# EAGLE board bms1818 (EAGLE 4.13), part 1 of 2
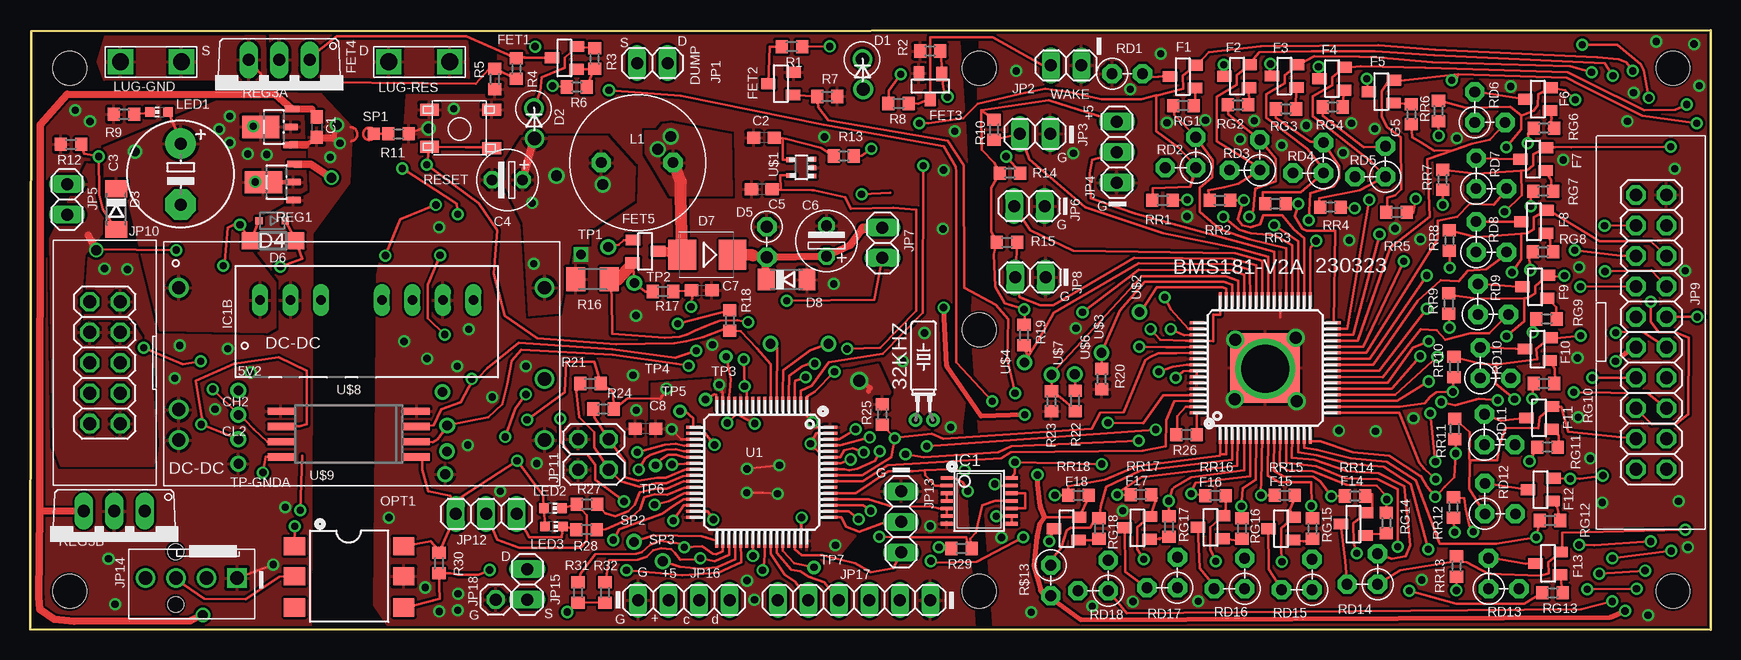
[diagram p2: board, top side]
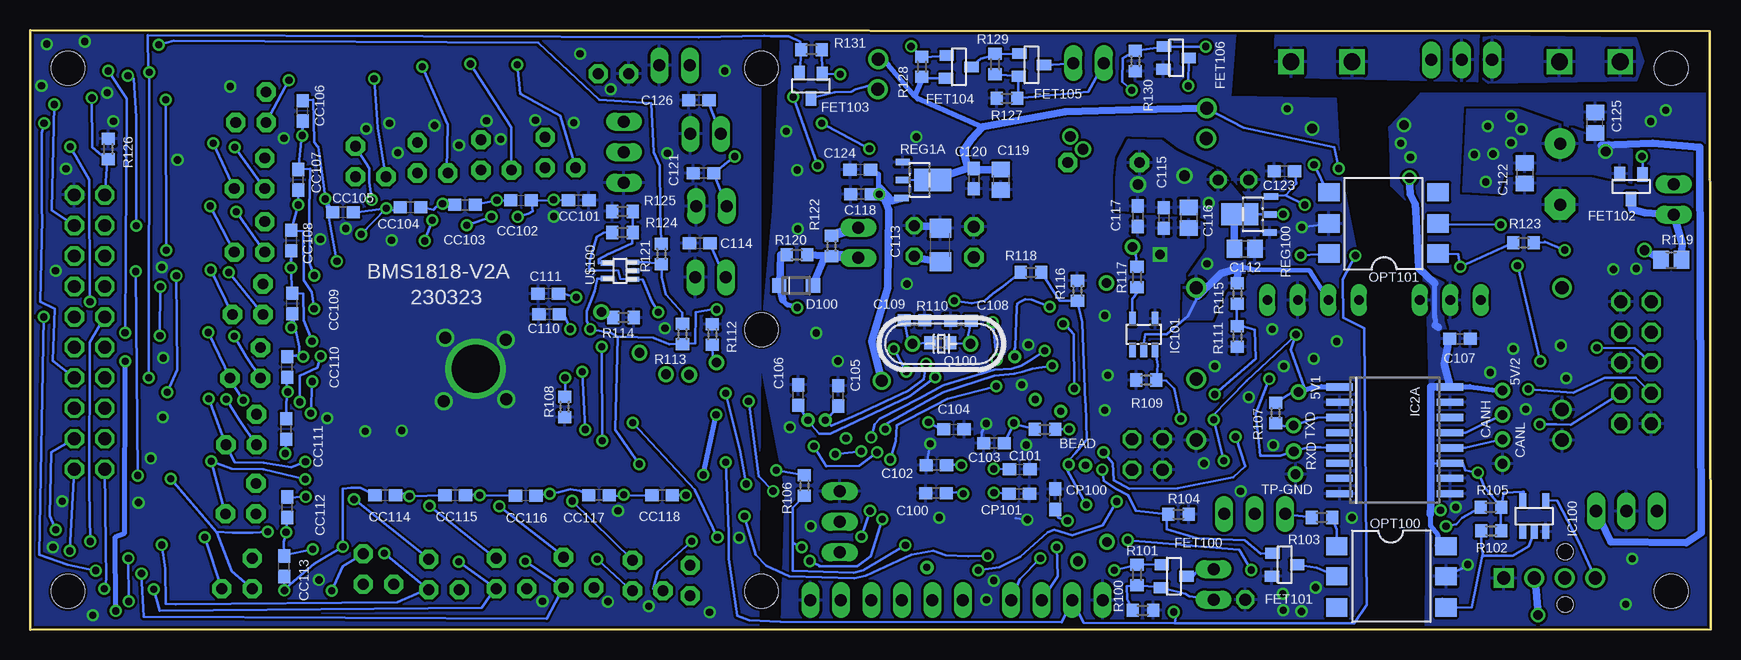
[diagram p3: board, bottom side, seen from below]

Size 140.07 x 49.98 mm. Coordinates in mm from the lower left corner, seen from the top.
Outline: 0,0.03 0.11,49.88 140.07,49.98 140.05,0 0,0.03
Copper layers (1*16): Top 0.035mm / dielectric 1.5mm / Bottom 0.035mm
Design rules "default": minimum track width 8mil, minimum drill 0.6mm, track to track 8mil, track to pad 8mil, pad to pad 8mil, via to via 8mil, smd to smd 0mil, copper to edge 8mil, drill to drill 8mil, minimum pad ring 10mil, minimum via ring 8mil, stop-mask expansion 4mil, vias tented up to drill 0mil, thermal gap 10mil
Holes 2.8 mm at 3.31,46.8 3.31,3.2 136.91,3.2 136.91,46.8 79.11,3.2 79.11,46.8 79.11,25

## Footprints (pad centres in the part's own frame; a part is rotated, then mirrored left to right if it is on the bottom)
SOLPAD028 = drill 0.8 pad 1.1 round: MP 0,0
32KHZ = drill 0.6 round: 1 -0.67,-3.1; 2 0.77,-3.1
R0603 = smd 1 x 1.1: 1 -0.85,0; 2 0.85,0
C0603 = smd 1.1 x 1: 1 -0.85,0; 2 0.85,0
E5-8,5 = drill 1.016 pad 2.54 round: + -2.54,0 | drill 1.016 pad 2.54 octagon: - 2.54,0
ES-2,5L = drill 0.889 pad 1.27 octagon: 1 0,0; 2 2.54,0
C0805 = smd 1.3 x 1.5: 1 -0.85,0; 2 0.85,0
C1206 = smd 1.6 x 1.8: 1 -1.4,0; 2 1.4,0
DO41-10_VERT = drill 1.1 round: A 2.58,0.05; C 0.07,0
SOD80C = smd 1.4 x 1.8: A 1.7,0; C -1.7,0
SOD323-R = smd 0.6 x 0.6: A 1.1,0; C -1.1,0
ZENER-VERT = drill 1 pad 1.6 octagon: 1 0,0; 2 2.54,0
SOD123 = smd 1.4 x 1.4: A 1.9,0; C -1.9,0
SMB_1 = smd 2.3 x 2.5: A 1.9,0; C -2.3,0
SOD123W = smd 1.2 x 1.2: A 1.4,0; C -1.4,0
SOT-23 = smd 0.9 x 1.2: 1 -1,-1.006; 2 0.9,-1.056; 3 -0.05,1.056
TO220V = drill 1.016 long: 1 -2.54,-2.54; 2 0,-2.54; 3 2.54,-2.54
TSSOP14 = smd 0.305 x 0.991: 1 -1.905,-2.718; 2 -1.27,-2.718; 3 -0.635,-2.718; 4 0,-2.718; 5 0.635,-2.718; 6 1.27,-2.718; 7 1.905,-2.718; 8 1.905,2.718; 9 1.27,2.718; 10 0.635,2.718; 11 0,2.718; 12 -0.635,2.718; 13 -1.27,2.718; 14 -1.905,2.718
DCDC7PINB = drill 0.813 long: 1 -7.62,2.51; 2 -5.08,2.51; 3 -2.54,2.51; 5 2.54,2.51; 6 5.08,2.51; 7 7.62,2.51; 8 10.16,2.51
SO-16DW = smd 0.6 x 2.2: 1 -4.445,-4.6; 2 -3.175,-4.6; 3 -1.905,-4.6; 4 -0.635,-4.6; 5 0.635,-4.6; 6 1.905,-4.6; 7 3.175,-4.6; 8 4.445,-4.6; 9 4.445,4.6; 10 3.175,4.6; 11 1.905,4.6; 12 0.635,4.6; 13 -0.635,4.6; 14 -1.905,4.6; 15 -3.175,4.6; 16 -4.445,4.6
SOT-23' = smd 0.6 x 1.2: 1 -0.95,-1.306; 2 0,-1.306; 3 0.95,-1.306; 4 0.95,1.306; 5 -0.95,1.306
SOT23-5 = smd 0.55 x 1.2: 1 -0.95,-1.3; 2 0,-1.3; 3 0.95,-1.3; 4 0.95,1.3; 5 -0.95,1.3
1X02 = drill 1 long: 1 -1.27,0; 2 1.27,0
1X03 = drill 1 long: 1 -2.54,0; 2 0,0; 3 2.54,0
2X10_KEYED = drill 1.067 octagon: 1 -11.46,-1.27; 2 -11.46,1.27; 3 -8.92,-1.27; 4 -8.92,1.27; 5 -6.38,-1.27; 6 -6.38,1.27; 7 -3.84,-1.27; 8 -3.84,1.27; 9 -1.3,-1.27; 10 -1.3,1.27; 11 1.24,-1.27; 12 1.24,1.27; 13 3.78,-1.27; 14 3.78,1.27; 15 6.32,-1.27; 16 6.32,1.27; 17 8.86,-1.27; 18 8.86,1.27; 19 11.4,-1.27; 20 11.4,1.27
2X05_KEYED = drill 1.067 octagon: 1 -5.08,-1.27; 2 -5.08,1.27; 3 -2.54,-1.27; 4 -2.54,1.27; 5 0,-1.27; 6 0,1.27; 7 2.54,-1.27; 8 2.54,1.27; 9 5.08,-1.27; 10 5.08,1.27
2X02 = drill 1.016 octagon: 1 -1.27,-1.27; 2 -1.27,1.27; 3 1.27,-1.27; 4 1.27,1.27
1X4-MOLEXKK = drill 1.1 square: 1 3.81,0 | drill 1.1 round: 2 1.27,0; 3 -1.27,0; 4 -3.81,0 | hole 1.3: -1.3,2.2; -1.3,-2.2
1X04 = drill 1 long: 1 -3.81,0; 2 -1.27,0; 3 1.27,0; 4 3.81,0
1X06 = drill 1 long: 1 -6.35,0; 2 -3.81,0; 3 -1.27,0; 4 1.27,0; 5 3.81,0; 6 6.35,0
1X01 = drill 1 octagon: 1 0,0
INDUCTOR6.0 = drill 0.9 pad 1.6 octagon: 1 -3.04,0; 2 2.94,0
CHIP-LED0603 = smd 0.8 x 0.8: A 0,-0.75; C 0,0.75
SPADE_TAB = drill 1.4 square: G1 -2.54,0; G2 2.54,0
SMD-6 = smd 1.52 x 1.78: P$1 -2.5,-4.5; P$2 0,-4.5; P$3 2.6,-4.5; P$4 2.6,4.6; P$5 0,4.6; P$6 -2.5,4.6
HC49/S = drill 0.8 round: 1 -2.413,0; 2 2.413,0
M1206 = smd 1.6 x 2: 1 -1.4,0; 2 1.4,0
R0805 = smd 1.3 x 1.5: 1 -0.85,0; 2 0.85,0
RS-2,5 = drill 0.889 pad 1.6 octagon: 1 0,0; 2 2.54,0
RS-2,5-2 = drill 0.889 pad 1.6 octagon: 1 0,0; 2 2.54,0; 3 0,2.54
SOT89 = smd 0.55 x 1.2: 1 -1.5,-1.4; 2 0,-1.4; 3 1.5,-1.5 | smd 1.85 x 3.1: 4 0,1.1
TO220V' = drill 1.016 long: 1 -3.81,-1.27; 2 -1.27,-1.27; 3 1.27,-1.27
E-SWITCH2 = smd 1.55 x 1: 1 -2.7,1.6; 2 2.5,1.5; 3 2.5,-1.6; 4 -2.7,-1.6
SMD03 = smd 1 x 1: 1 0,0
SOLPAD.6MM = drill 0.6 pad 1.1 round: MP 0,0
TQFP64 = smd 1.2 x 0.26: 1 -5.7,3.75; 2 -5.7,3.25; 3 -5.7,2.75; 4 -5.7,2.25; 5 -5.7,1.75; 6 -5.7,1.25; 7 -5.7,0.75; 8 -5.7,0.25; 9 -5.7,-0.25; 10 -5.7,-0.75; 11 -5.7,-1.25; 12 -5.7,-1.75; 13 -5.7,-2.25; 14 -5.7,-2.75; 15 -5.7,-3.25; 16 -5.7,-3.75; 33 5.7,-3.75; 34 5.7,-3.25; 35 5.7,-2.75; 36 5.7,-2.25; 37 5.7,-1.75; 38 5.7,-1.25; 39 5.7,-0.75; 40 5.7,-0.25; 41 5.7,0.25; 42 5.7,0.75; 43 5.7,1.25; 44 5.7,1.75; 45 5.7,2.25; 46 5.7,2.75; 47 5.7,3.25; 48 5.7,3.75 | smd 0.26 x 1.2: 17 -3.75,-5.7; 18 -3.25,-5.7; 19 -2.75,-5.7; 20 -2.25,-5.7; 21 -1.75,-5.7; 22 -1.25,-5.7; 23 -0.75,-5.7; 24 -0.25,-5.7; 25 0.25,-5.7; 26 0.75,-5.7; 27 1.25,-5.7; 28 1.75,-5.7; 29 2.25,-5.7; 30 2.75,-5.7; 31 3.25,-5.7; 32 3.75,-5.7; 49 3.75,5.7; 50 3.25,5.7; 51 2.75,5.7; 52 2.25,5.7; 53 1.75,5.7; 54 1.25,5.7; 55 0.75,5.7; 56 0.25,5.7; 57 -0.25,5.7; 58 -0.75,5.7; 59 -1.25,5.7; 60 -1.75,5.7; 61 -2.25,5.7; 62 -2.75,5.7; 63 -3.25,5.7; 64 -3.75,5.7
SOT-323-5 = smd 0.4 x 0.6: 1 -0.7,-0.95; 2 0,-0.95; 3 0.7,-0.95; 4 0.65,0.95; 5 -0.65,0.95
TQFP64_PAD = smd 1.2 x 0.26: 1 -5.7,3.75; 2 -5.7,3.25; 3 -5.7,2.75; 4 -5.7,2.25; 5 -5.7,1.75; 6 -5.7,1.25; 7 -5.7,0.75; 8 -5.7,0.25; 9 -5.7,-0.25; 10 -5.7,-0.75; 11 -5.7,-1.25; 12 -5.7,-1.75; 13 -5.7,-2.25; 14 -5.7,-2.75; 15 -5.7,-3.25; 16 -5.7,-3.75; 33 5.7,-3.75; 34 5.7,-3.25; 35 5.7,-2.75; 36 5.7,-2.25; 37 5.7,-1.75; 38 5.7,-1.25; 39 5.7,-0.75; 40 5.7,-0.25; 41 5.7,0.25; 42 5.7,0.75; 43 5.7,1.25; 44 5.7,1.75; 45 5.7,2.25; 46 5.7,2.75; 47 5.7,3.25; 48 5.7,3.75 | smd 0.26 x 1.2: 17 -3.75,-5.7; 18 -3.25,-5.7; 19 -2.75,-5.7; 20 -2.25,-5.7; 21 -1.75,-5.7; 22 -1.25,-5.7; 23 -0.75,-5.7; 24 -0.25,-5.7; 25 0.25,-5.7; 26 0.75,-5.7; 27 1.25,-5.7; 28 1.75,-5.7; 29 2.25,-5.7; 30 2.75,-5.7; 31 3.25,-5.7; 32 3.75,-5.7; 49 3.75,5.7; 50 3.25,5.7; 51 2.75,5.7; 52 2.25,5.7; 53 1.75,5.7; 54 1.25,5.7; 55 0.75,5.7; 56 0.25,5.7; 57 -0.25,5.7; 58 -0.75,5.7; 59 -1.25,5.7; 60 -1.75,5.7; 61 -2.25,5.7; 62 -2.75,5.7; 63 -3.25,5.7; 64 -3.75,5.7 | smd 5.8 x 5.8: V- 0,0
SOIC-8 = smd 0.6 x 2.2: 1 -1.905,-5.6; 2 -0.635,-5.6; 3 0.635,-5.6; 4 1.905,-5.6; 5 1.905,5.7; 6 0.635,5.7; 7 -0.635,5.7; 8 -1.905,5.7
PYJ6-OD = drill 1.1 round: P$1 -7.62,12.7; P$2 -7.62,2.54; P$3 -7.62,0; P$4 22.86,0; P$5 22.86,5.08; P$6 22.86,12.7
SC-70-5 = smd 0.4 x 0.95: 1 -0.705,-1.126; 2 -0.005,-1.126; 3 0.695,-1.126 | smd 0.45 x 0.95: 4 0.645,1.136; 5 -0.655,1.136

## Placement (x,y rotation side)
5V1  SOLDPAD028  [SOLPAD028]  34.37,19.81 0 top
5V2  SOLDPAD028  [SOLPAD028]  17.36,19.95 0 top
32KHZ  X100  [32KHZ]  74.47,20.57 0 top
BEAD  1  [R0603]  55.5,16.7 180 bottom
C1  1u 25v  [C0603]  23.9,41.88 270 top
C2  1u  [C0603]  61.17,41 180 top
C3  0.1u 25v  [E5-8,5]  12.56,37.97 270 top
C4  10@25V  [ES-2,5L]  41.05,37.49 180 top
C5  1u  [C0603]  60.98,36.69 180 top
C6  1u@100v  [ES-2,5L]  66.38,31.13 90 top
C7  0.1u  [C0603]  55.98,28.28 0 top
C8  0.1u  [C0603]  51.29,16.76 180 top
C100  0.1u  [C0603]  64.57,11.38 180 bottom
C101  0.1u  [C0603]  57.59,13.38 0 bottom
C102  1u  [C0603]  64.54,13.73 180 bottom
C103  100n  [C0603]  59.74,15.54 180 bottom
C104  0.1u  [C0603]  63.08,16.71 0 bottom
C105  22p  [C0603]  72.7,19.49 90 bottom
C106  22p  [C0603]  76.04,19.55 90 bottom
C107  4.7u 10v  [C0603]  20.91,24.25 0 bottom
C108  33p  [C0603]  62.49,25.76 180 bottom
C109  33p  [C0603]  66.37,25.78 0 bottom
C110  1u  [C0603]  96.81,26.28 180 bottom
C111  1u  [C0603]  96.88,28.01 180 bottom
C112  4.7u 25v  [C0805]  38.84,31.76 0 bottom
C113  1u@100v  [C1206]  64.2,32.06 90 bottom
C114  1u  [C0603]  84.26,32.2 180 bottom
C115  10n  [C0603]  45.59,34.32 270 bottom
C116  4.7u 25v  [C0805]  43.51,34.34 270 bottom
C117  0.1u 25v  [C0603]  47.76,34.46 270 bottom
C118  0.1u  [C0603]  70.82,36.31 180 bottom
C119  4.7u 25v  [C0805]  59.16,37.5 270 bottom
C120  0.1u 25v  [C0603]  61.42,37.59 270 bottom
C121  1u  [C0603]  83.95,38.04 180 bottom
C122  4.7u 25v  [C0805]  15.51,38.04 270 bottom
C123  4.7u 10v  [C0603]  35.54,38.2 180 bottom
C124  4.7u  [C0603]  70.88,38.33 180 bottom
C125  4.7u 25v  [C0805]  9.65,42.26 90 bottom
C126  1u  [C0603]  84.33,44.14 180 bottom
CANH  SOLDPAD028  [SOLPAD028]  17.36,17.91 0 top
CANL  SOLDPAD028  [SOLPAD028]  17.36,15.87 0 top
CC101  0.1u  [C0603]  94.34,35.8 0 bottom
CC102  0.1u  [C0603]  99.16,35.78 0 bottom
CC103  0.1u  [C0603]  103.82,35.42 0 bottom
CC104  0.1u  [C0603]  108.36,35.22 0 bottom
CC105  0.1u  [C0603]  113.99,34.81 0 bottom
CC106  0.1u  [C0603]  117.36,43.24 90 bottom
CC107  0.1u  [C0603]  117.71,37.5 90 bottom
CC108  0.1u  [C0603]  118.28,32.44 90 bottom
CC109  0.1u  [C0603]  118.23,27.18 90 bottom
CC110  0.1u  [C0603]  118.64,21.9 90 bottom
CC111  0.1u  [C0603]  118.72,16.73 90 bottom
CC112  0.1u  [C0603]  118.62,10.21 90 bottom
CC113  0.1u  [C0603]  118.89,5.29 90 bottom
CC114  0.1u  [C0603]  110.47,11.19 180 bottom
CC115  0.1u  [C0603]  104.63,11.2 180 bottom
CC116  0.1u  [C0603]  98.76,11.18 180 bottom
CC117  0.1u  [C0603]  92.66,11.23 180 bottom
CC118  0.1u  [C0603]  87.39,11.2 180 bottom
CP100  4.7u 6.3v  [C0603]  54.65,10.88 90 bottom
CP101  4.7u 6.3  [C0603]  57.63,11.33 0 bottom
D1  1N4148  [DO41-10_VERT]  69.38,47.62 270 top
D2  1N4148  [DO41-10_VERT]  42,43.52 270 top
D3  MMSZ52  [SOD80C]  7.19,35.05 270 top
D4  [SOD323-R]  20.18,34.09 180 top
D5  1N5357  [ZENER-VERT]  61.41,33.58 270 top
D6  1N4148  [SOD123]  20.26,32.41 180 top
D7  MBRS1100  [SMB_1]  56.25,31.23 180 top
D8  MMSZ52  [SOD80C]  63.05,29.18 0 top
D100  PMEG10020  [SOD123W]  76.23,28.68 180 bottom
F1  [SOT-23]  96.07,46.15 90 top
F2  [SOT-23]  100.59,46.18 90 top
F3  [SOT-23]  104.54,46.19 90 top
F4  [SOT-23]  108.5,45.97 90 top
F5  [SOT-23]  112.62,44.89 90 top
F6  [SOT-23]  125.66,44.27 90 top
F7  [SOT-23]  125.27,39.27 90 top
F8  [SOT-23]  125.33,34.05 90 top
F9  [SOT-23]  125.43,28.63 90 top
F10  [SOT-23]  125.64,23.44 90 top
F11  [SOT-23]  125.77,17.7 90 top
F12  [SOT-23]  125.89,11.73 90 top
F13  [SOT-23]  126.51,5.58 90 top
F14  [SOT-23]  110.29,8.86 90 top
F15  [SOT-23]  104.25,8.48 90 top
F16  [SOT-23]  98.38,8.59 90 top
F17  [SOT-23]  92.28,8.54 90 top
F18  [SOT-23]  86.38,8.48 90 top
FET1  PFET -20V  [SOT-23]  44.54,47.71 90 top
FET2  NFET 20V  [SOT-23]  62.58,45.56 90 top
FET3  NFET 20V  [SOT-23]  74.98,45.3 180 top
FET4  NFET 100V  [TO220V]  20.77,44.95 180 top
FET5  PMV280ENEA  [SOT-23]  51.27,31.48 270 top
FET100  NFET  [SOT-23]  44.75,4.41 270 bottom
FET101  NFET  [SOT-23]  35.52,5.37 270 bottom
FET102  PMV35EPE  [SOT-23]  6.7,36.94 180 bottom
FET103  PFET -20V  [SOT-23]  75.04,45.33 180 bottom
FET104  PFET -20V  [SOT-23]  62.67,46.85 270 bottom
FET105  NFET 100V si2324A  [SOT-23]  56.62,47.02 270 bottom
FET106  NFET 20V  [SOT-23]  44.56,47.6 270 bottom
G5  3.3K  [R0603]  115.11,42.96 90 top
IC1  7402  [TSSOP14]  79.1,10.74 270 top
IC1B  AM6G1215SNZ  [DCDC7PINB]  26.79,24.97 0 top
IC2A  ISO1042-16PIN  [SO-16DW]  26.33,15.79 270 bottom
IC100  74LVC1G14  [SOT-23']  14.72,9.47 0 bottom
IC101  MCP1401|1416  [SOT23-5]  47.26,24.62 0 bottom
JP1  DUMP  [1X02]  51.86,47.22 0 top
JP2  PB  [1X02]  86.35,47.03 180 top
JP3  THERM1  [1X02]  83.76,41.32 180 top
JP4  [1X03]  90.58,39.8 90 top
JP5  Dump2  [1X02]  3.09,35.86 90 top
JP6  THERM3  [1X02]  83.28,35.31 180 top
JP7  [1X02]  71.04,32.25 90 top
JP8  THERM2  [1X02]  83.36,29.37 180 top
JP9  PINHD-2X10_KEYED  [2X10_KEYED]  135.1,24.77 270 top
JP10  PINHD-2X5_KEYED  [2X05_KEYED]  6.24,22.26 90 top
JP11  [2X02]  46.96,14.61 270 top
JP12  [1X03]  38.02,9.65 0 top
JP13  SWD  [1X03]  72.59,8.99 270 top
JP14  PINHD-1X4-MOLEXKK  [1X4-MOLEXKK]  13.44,4.31 0 top
JP15  Dump2  [1X02]  41.44,3.79 90 top
JP16  [1X04]  54.49,2.48 0 top
JP17  FTDI  [1X06]  68.68,2.48 180 top
JP18  [1X01]  38.81,2.52 0 top
L1  RFB1010  [INDUCTOR6.0]  50.65,38.93 0 top
LED1  [CHIP-LED0603]  10.75,43.15 90 top
LED2  [CHIP-LED0603]  43.58,10.13 270 top
LED3  [CHIP-LED0603]  43.66,8.61 270 top
LUG-GND  MINUS  [SPADE_TAB]  10.08,47.33 0 top
LUG-RES  RESIS  [SPADE_TAB]  32.44,47.33 0 top
OPT1  H11L1S  [SMD-6]  26.55,4.46 270 top
OPT100  H11L1S  [SMD-6]  26.67,4.46 270 bottom
OPT101  H11L1S  [SMD-6]  27.23,33.85 90 bottom
Q100  8 MHz  [HC49/S]  64.12,23.83 180 bottom
R1  270K  [R0603]  63.49,48.59 180 top
R2  1M  [R0603]  75.02,48.23 0 top
R3  1M  [R0603]  47.05,47.59 90 top
R4  100K  [R0603]  40.53,46.76 90 top
R5  1K  [R0603]  38.73,45.89 270 top
R6  270K  [R0603]  45.56,45.23 180 top
R7  1M  [R0603]  66.44,44.44 0 top
R8  270K  [R0603]  72.39,43.86 0 top
R9  10K  [R0603]  7.83,42.96 0 top
R10  10K  [R0603]  80.34,41.67 270 top
R11  10M  [R0603]  30.71,41.33 0 top
R12  1M  [R0603]  3.42,40.45 180 top
R13  100K  [R0603]  67.81,39.48 0 top
R14  10K  [R0603]  81.65,38.05 0 top
R15  10K  [R0603]  81.42,32.28 0 top
R16  0.1  [M1206]  46.88,29.21 0 top
R17  1.2K  [R0603]  52.75,28.19 0 top
R18  10K  [R0603]  58.32,25.77 90 top
R19  10K  [R0603]  82.83,24.56 270 top
R20  TBD  [R0603]  89.31,20.89 90 top
R21  10K  [R0603]  46.7,20.52 0 top
R22  TBD  [R0603]  87.1,19.08 90 top
R23  TBD  [R0603]  85.12,19.04 90 top
R24  10K  [R0603]  47.78,18.39 0 top
R25  3.9K  [R0603]  71.02,17.95 90 top
R26  100  [R0603]  96.38,16.26 180 top
R27  6.8K  [R0603]  46.42,10.46 0 top
R28  3.3K  [R0603]  46.38,8.34 0 top
R29  470K  [R0603]  77.63,6.77 180 top
R30  10K  [R0603]  34.08,5.55 90 top
R31  3.3K  [R0603]  45.67,3.11 270 top
R32  3.3K  [R0603]  47.92,3.1 270 top
R100  10K  [R0603]  47.33,1.62 0 bottom
R101  1M  [R0603]  47.82,4.57 270 bottom
R102  10K  [R0603]  18.3,8.24 0 bottom
R103  1.8K  [R0603]  32.42,9.36 180 bottom
R104  1M  [R0603]  44.36,9.62 0 bottom
R105  1.8K  [R0603]  18.33,10.2 180 bottom
R106  470K  [R0603]  75.54,12.02 270 bottom
R107  100K  [R0603]  36.26,18.06 90 bottom
R108  18K  [R0603]  95.52,18.57 90 bottom
R109  100K  [R0603]  47.05,20.81 0 bottom
R110  1M  [R0603]  64.22,23.91 0 bottom
R111  6.8K  [R0603]  39.46,24.45 270 bottom
R112  OPEN?  [R0603]  83.21,24.62 90 bottom
R113  47k  [R0603]  85.7,24.63 90 bottom
R114  TBD  [R0603]  90.61,26.02 180 bottom
R115  33K  [R0603]  39.46,28.03 270 bottom
R116  3.3K  [R0603]  52.78,28.25 270 bottom
R117  6.8  [R0603]  47.82,29.38 270 bottom
R118  68K  [R0603]  56.65,29.78 180 bottom
R119  0.1  [R0805]  3.3,30.82 0 bottom
R120  open  [R0603]  76.16,31.25 0 bottom
R121  1.2K  [R0603]  87.46,31.33 270 bottom
R122  1  [R0603]  73.28,31.98 270 bottom
R123  3.3K  [R0603]  15.6,32.25 180 bottom
R124  10K  [R0603]  90.69,33.11 0 bottom
R125  1.2K  [R0603]  90.69,34.86 0 bottom
R126  open  [R0603]  133.55,40.06 270 bottom
R127  1  [R0603]  58.67,44.29 0 bottom
R128  1M  [R0603]  65.75,46.92 270 bottom
R129  100K  [R0603]  59.65,47.13 90 bottom
R130  1M  [R0603]  47.96,47.39 90 bottom
R131  1M  [R0603]  74.94,48.34 180 bottom
R$13  33  [RS-2,5]  85.06,5.38 270 top
RD1  33  [RS-2,5]  90.17,46.34 0 top
RD2  33  [RS-2,5-2]  97.14,38.5 90 top
RD3  33  [RS-2,5-2]  102.49,38.3 90 top
RD4  33  [RS-2,5-2]  107.79,38.06 90 top
RD5  33  [RS-2,5-2]  112.95,37.75 90 top
RD6  33  [RS-2,5-2]  120.39,42.28 0 top
RD7  33  [RS-2,5-2]  120.51,36.76 0 top
RD8  33  [RS-2,5-2]  120.51,31.47 0 top
RD9  33  [RS-2,5-2]  120.66,26.28 0 top
RD10  33  [RS-2,5-2]  120.86,20.97 0 top
RD11  33  [RS-2,5-2]  121.2,15.42 0 top
RD12  33  [RS-2,5-2]  121.24,9.66 0 top
RD13  33  [RS-2,5-2]  121.55,3.42 0 top
RD14  33  [RS-2,5-2]  112.3,3.79 90 top
RD15  33  [RS-2,5-2]  106.84,3.34 90 top
RD16  33  [RS-2,5-2]  101.22,3.42 90 top
RD17  33  [RS-2,5-2]  95.62,3.5 90 top
RD18  33  [RS-2,5-2]  89.86,3.25 90 top
REG1  AP7380Y  [SOT89]  20.55,37.3 90 top
REG1A  AP7380Y  [SOT89]  65.94,37.48 270 bottom
REG3A  LDK320ADU120R  [SOT89]  20.32,41.9 90 top
REG3B  LM7812T  [TO220V']  5.76,8.62 180 top
REG100  AP7380Y  [SOT89]  38.16,34.62 90 bottom
RESET  RESET  [E-SWITCH2]  35.78,41.74 180 top
RG1  3.3K  [R0603]  96.11,43.67 0 top
RG2  3.3K  [R0603]  100.65,43.74 0 top
RG3  3.3K  [R0603]  104.67,43.4 0 top
RG4  3.3K  [R0603]  108.56,43.57 0 top
RG6  3.3K  [R0603]  126.18,41.8 0 top
RG7  3.3K  [R0603]  126.1,36.55 0 top
RG8  3.3K  [R0603]  126.09,31.49 0 top
RG9  3.3K  [R0603]  126.39,25.9 0 top
RG10  3.3K  [R0603]  126.15,20.53 0 top
RG11  3.3K  [R0603]  126.46,15.22 0 top
RG12  3.3K  [R0603]  126.68,9.1 0 top
RG13  3.3K  [R0603]  126.89,3.08 0 top
RG14  3.3K  [R0603]  113.03,8.91 270 top
RG15  3.3K  [R0603]  106.87,8.43 270 top
RG16  3.3K  [R0603]  101,8.44 270 top
RG17  3.3K  [R0603]  94.92,8.59 270 top
RG18  3.3K  [R0603]  89.09,8.44 270 top
RR1  10  [R0603]  94.39,35.79 180 top
RR2  10  [R0603]  99.15,35.79 180 top
RR3  10  [R0603]  103.79,35.5 180 top
RR4  10  [R0603]  108.37,35.22 180 top
RR5  10  [R0603]  113.89,34.78 180 top
RR6  10  [R0603]  117.37,43.24 90 top
RR7  10  [R0603]  117.72,37.5 90 top
RR8  10  [R0603]  118.28,32.44 90 top
RR9  10  [R0603]  118.23,27.18 90 top
RR10  10  [R0603]  118.66,21.91 90 top
RR11  10  [R0603]  118.73,16.73 90 top
RR12  10  [R0603]  118.62,10.2 90 top
RR13  10  [R0603]  118.88,5.28 90 top
RR14  10  [R0603]  110.43,11.14 0 top
RR15  10  [R0603]  104.56,11.2 0 top
RR16  10  [R0603]  98.78,11.18 0 top
RR17  10  [R0603]  92.57,11.26 0 top
RR18  10  [R0603]  87.38,11.2 0 top
RXD  SOLDPAD028  [SOLPAD028]  34.76,14.87 0 top
SP1  SMD03  [SMD03]  28.63,41.34 0 top
SP2  SOLDPAD028  [SOLPAD028]  50.33,7.33 0 top
SP3  SOLDPAD028  [SOLPAD028]  52.73,5.71 0 top
TP1  SOLDPAD028  [SOLPAD028]  48.19,31.9 0 top
TP2  SOLDPAD028  [SOLPAD028]  50.36,28.9 0 top
TP3  SOLDPAD0.6MM  [SOLPAD.6MM]  58.01,22.75 0 top
TP4  SOLDPAD0.6MM  [SOLPAD.6MM]  56.3,19.19 0 top
TP5  SOLDPAD0.6MM  [SOLPAD.6MM]  54.17,18.21 0 top
TP6  SOLDPAD0.6MM  [SOLPAD.6MM]  52.12,13.7 0 top
TP7  SOLDPAD0.6MM  [SOLPAD.6MM]  65.33,5.2 0 top
TP-GND  SOLDPAD028  [SOLPAD028]  34.6,12.96 0 top
TP-GNDA  SOLDPAD028  [SOLPAD028]  17.36,13.83 0 top
TXD  SOLDPAD028  [SOLPAD028]  34.77,17.01 0 top
U1  STM32F10XRXT6  [TQFP64]  60.99,13.12 270 top
U$1  STLQ50  [SOT-323-5]  64.29,38.51 90 top
U$2  SOLDPAD028  [SOLPAD028]  92.46,26.47 90 top
U$3  SOLDPAD028  [SOLPAD028]  89.29,23.08 0 top
U$4  SOLDPAD028  [SOLPAD028]  82.87,22.26 0 top
U$5  LTC6813  [TQFP64_PAD]  102.93,21.82 90 top
U$6  SOLDPAD028  [SOLPAD028]  87.06,21.29 180 top
U$7  SOLDPAD028  [SOLPAD028]  85.14,21.25 0 top
U$8  ISO1042  [SOIC-8]  26.61,16.31 90 top
U$9  PY6J6-OD  [PYJ6-OD]  20.02,15.81 0 top
U$100  MCP6006  [SC-70-5]  90.9,29.92 90 bottom